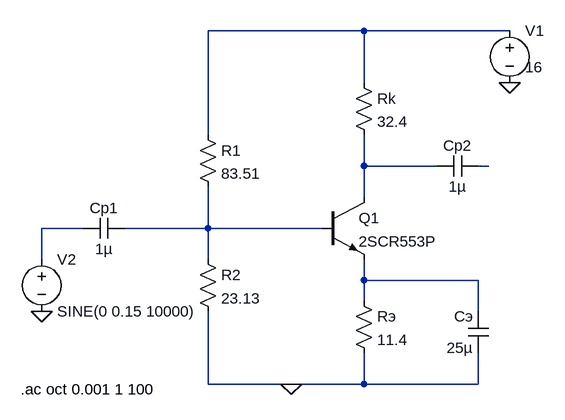
[diagram p0: schematic Draft2.asc]
Draft2.asc, the LTspice schematic file:
Version 4
SHEET 1 880 680
WIRE 432 -64 192 -64
WIRE 656 -64 432 -64
WIRE 432 16 432 -64
WIRE 192 96 192 -64
WIRE 432 144 432 96
WIRE 544 144 432 144
WIRE 624 144 608 144
WIRE 432 192 432 144
WIRE 0 240 -64 240
WIRE 192 240 192 176
WIRE 192 240 64 240
WIRE 368 240 192 240
WIRE -64 288 -64 240
WIRE 192 288 192 240
WIRE 432 320 432 288
WIRE 608 320 432 320
WIRE 432 352 432 320
WIRE 608 368 608 320
WIRE 192 480 192 368
WIRE 320 480 192 480
WIRE 432 480 432 432
WIRE 432 480 320 480
WIRE 608 480 608 432
WIRE 608 480 432 480
FLAG 656 16 0
FLAG -64 368 0
FLAG 320 480 0
SYMBOL npn 368 192 R0
SYMATTR InstName Q1
SYMATTR Value 2SCR553P
SYMBOL voltage 656 -80 R0
WINDOW 123 24 44 Left 2
WINDOW 39 0 0 Left 0
WINDOW 3 24 72 Left 2
SYMATTR InstName V1
SYMATTR Value 16
SYMBOL res 416 0 R0
SYMATTR InstName Rk
SYMATTR Value 32.4
SYMBOL res 416 336 R0
SYMATTR InstName Rэ
SYMATTR Value 11.4
SYMBOL res 176 272 R0
SYMATTR InstName R2
SYMATTR Value 23.13
SYMBOL res 176 80 R0
SYMATTR InstName R1
SYMATTR Value 83.51
SYMBOL cap 608 128 R90
WINDOW 0 0 32 VBottom 2
WINDOW 3 32 32 VTop 2
SYMATTR InstName Cp2
SYMATTR Value 1µ
SYMBOL cap 64 224 R90
WINDOW 0 0 32 VBottom 2
WINDOW 3 32 32 VTop 2
SYMATTR InstName Cp1
SYMATTR Value 1µ
SYMBOL cap 624 432 R180
WINDOW 0 24 56 Left 2
WINDOW 3 24 8 Left 2
SYMATTR InstName Cэ
SYMATTR Value 25µ
SYMBOL voltage -64 272 R0
WINDOW 123 0 0 Left 0
WINDOW 39 0 0 Left 0
SYMATTR InstName V2
SYMATTR Value SINE(0 0.15 10000)
TEXT -96 488 Left 2 !.ac oct 0.001 1 100

The netlist it stands for:
* Draft2.asc
Q1 N002 N005 N006 0 2SCR553P
V1 N001 0 16
Rk N001 N002 32.4
Rэ N006 0 11.4
R2 N005 0 23.13
R1 N001 N005 83.51
Cp2 N003 N002 1µ
Cp1 N005 N004 1µ
Cэ 0 N006 25µ
V2 N004 0 SINE(0 0.15 10000)
.model NPN NPN
.model PNP PNP
.lib standard.bjt
.ac oct 0.001 1 100
.backanno
.end